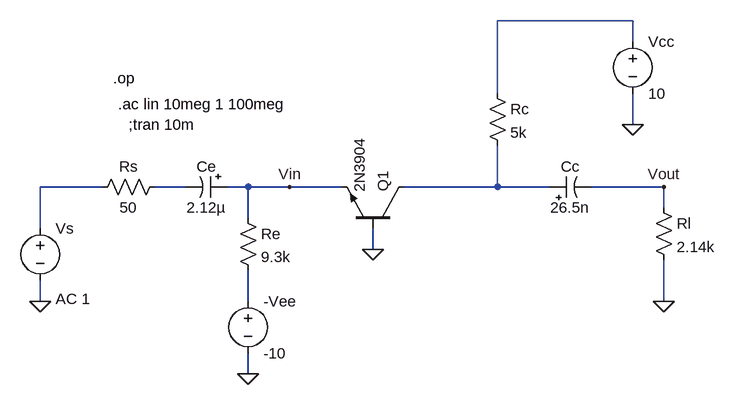
[diagram p0: schematic Common_base_ltspice.asc]
Common_base_ltspice.asc, the LTspice schematic file:
Version 4
SHEET 1 1244 680
WIRE 640 -112 432 -112
WIRE 640 -80 640 -112
WIRE 432 0 432 -112
WIRE 640 48 640 0
WIRE -176 144 -272 144
WIRE -48 144 -96 144
WIRE 48 144 16 144
WIRE 112 144 48 144
WIRE 192 144 112 144
WIRE 432 144 432 80
WIRE 432 144 288 144
WIRE 512 144 432 144
WIRE 688 144 576 144
WIRE 688 176 688 144
WIRE 48 192 48 144
WIRE -272 208 -272 144
WIRE 240 240 240 208
WIRE -272 320 -272 288
WIRE 48 320 48 272
WIRE 688 320 688 256
WIRE 48 432 48 400
FLAG -272 320 0
FLAG 240 240 0
FLAG 688 320 0
FLAG 48 432 0
FLAG 640 48 0
FLAG 688 144 Vout
FLAG 112 144 Vin
SYMBOL npn 288 208 M270
SYMATTR InstName Q1
SYMATTR Value 2N3904
SYMBOL res 32 176 R0
SYMATTR InstName Re
SYMATTR Value 9.3k
SYMBOL res -80 128 R90
WINDOW 0 0 56 VBottom 2
WINDOW 3 32 56 VTop 2
SYMATTR InstName Rs
SYMATTR Value 50
SYMBOL polcap 16 128 R90
WINDOW 0 0 32 VBottom 2
WINDOW 3 32 32 VTop 2
SYMATTR InstName Ce
SYMATTR Value 2.12µ
SYMATTR Description Capacitor
SYMATTR Type cap
SYMATTR SpiceLine V=20 Irms=1.12694 Rser=0.1 Lser=0
SYMBOL voltage -272 192 R0
WINDOW 3 24 44 Left 2
WINDOW 123 24 124 Left 2
WINDOW 39 0 0 Left 0
SYMATTR Value ""
SYMATTR Value2 AC 1
SYMATTR InstName Vs
SYMBOL res 416 -16 R0
SYMATTR InstName Rc
SYMATTR Value 5k
SYMBOL voltage 640 -96 R0
WINDOW 123 0 0 Left 0
WINDOW 39 0 0 Left 0
SYMATTR InstName Vcc
SYMATTR Value 10
SYMBOL polcap 512 160 R270
WINDOW 0 32 32 VTop 2
WINDOW 3 0 32 VBottom 2
SYMATTR InstName Cc
SYMATTR Value 26.5n
SYMATTR Description Capacitor
SYMATTR Type cap
SYMATTR SpiceLine V=16 Irms=0 Rser=11 Lser=0
SYMBOL res 672 160 R0
SYMATTR InstName Rl
SYMATTR Value 2.14k
SYMBOL voltage 48 304 R0
WINDOW 123 0 0 Left 0
WINDOW 39 0 0 Left 0
SYMATTR InstName -Vee
SYMATTR Value -10
TEXT -160 -24 Left 2 !.op
TEXT -152 16 Left 2 !.ac lin 10meg 1 100meg
TEXT -136 48 Left 2 !;tran 10m

The netlist it stands for:
* Common_base_ltspice.asc
Q1 N004 0 Vin 0 2N3904
Re Vin N005 9.3k
Rs N003 N002 50
Ce Vin N003 2.12µ V=20 Irms=1.12694 Rser=0.1 Lser=0
Vs N002 0 AC 1
Rc N001 N004 5k
Vcc N001 0 10
Cc N004 Vout 26.5n V=16 Irms=0 Rser=11 Lser=0
Rl Vout 0 2.14k
V§-Vee N005 0 -10
.model NPN NPN
.model PNP PNP
.lib standard.bjt
.op
.ac lin 10meg 1 100meg
;tran 10m
.backanno
.end